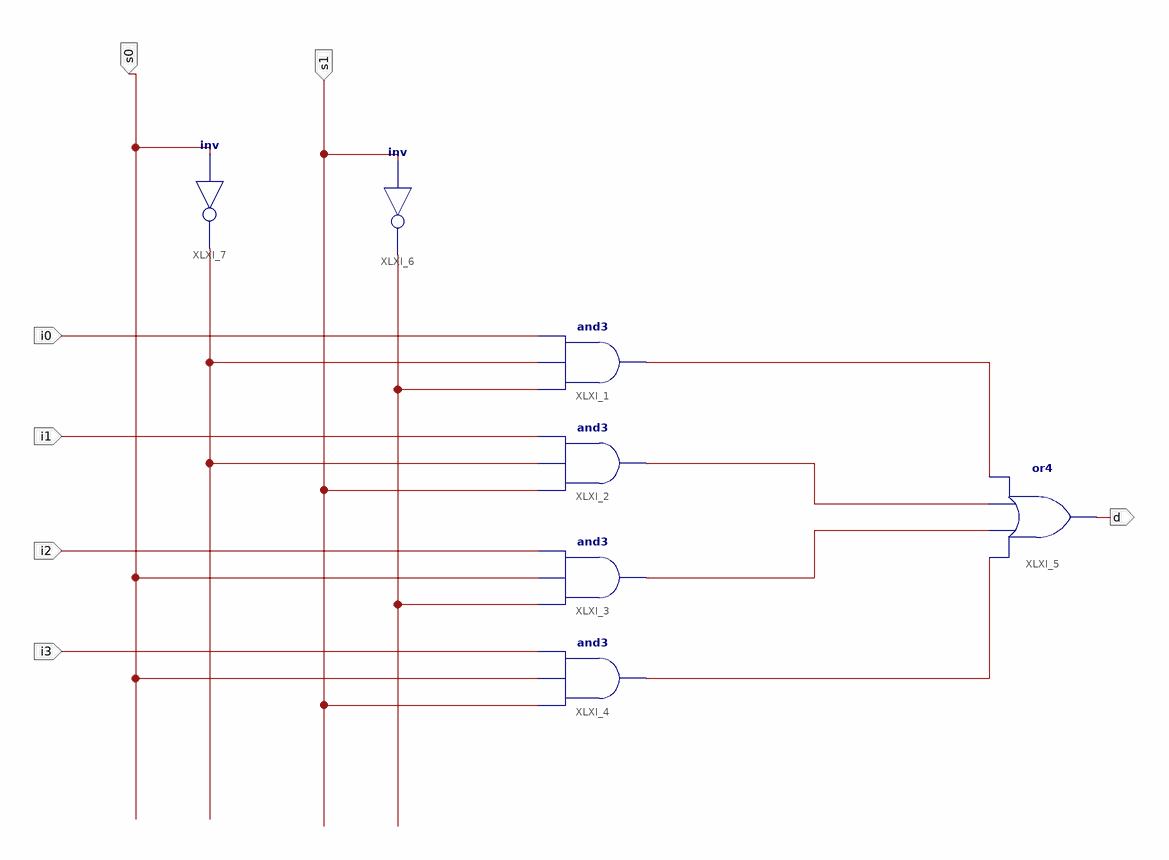
[diagram p0: schematic sheet 1]
// Xilinx ISE schematic mux.sch (spartan3e) as structural Verilog: 7 symbols, 7 ports
module mux (
  input  s1,
  input  s0,
  input  i0,
  input  i1,
  input  i2,
  input  i3,
  output d
);

  wire XLXN_1, XLXN_2, XLXN_3, XLXN_4, XLXN_7, XLXN_8;

  and XLXI_1 (XLXN_4, XLXN_8, XLXN_7, i0);
  and XLXI_2 (XLXN_1, s1, XLXN_7, i1);
  and XLXI_3 (XLXN_2, XLXN_8, s0, i2);
  and XLXI_4 (XLXN_3, s1, s0, i3);
  or XLXI_5 (d, XLXN_3, XLXN_2, XLXN_1, XLXN_4);
  not XLXI_6 (XLXN_8, s1);
  not XLXI_7 (XLXN_7, s0);
endmodule
